# Altium project 音频.PrjPcb
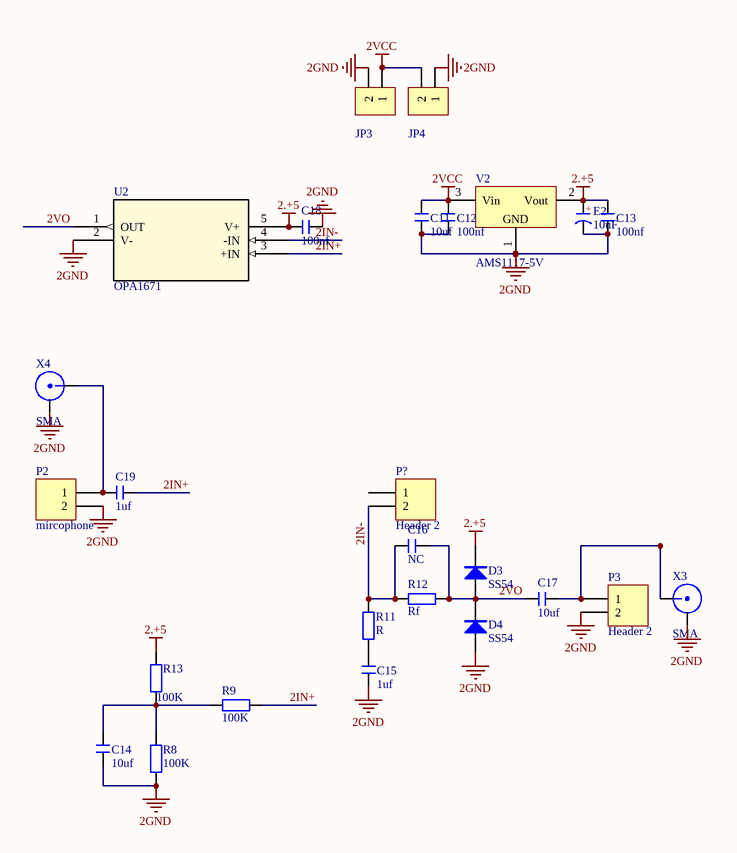
[diagram p0: OPA1671.SchDoc]
2 sheets, 53 parts. Net scope: global (net labels, ports and power ports of the same name join across sheets).
Board file: SoundAmplify.PcbDoc
Sheets:
  OPA1671.SchDoc
  OPA567.SchDoc

## Sheet OPA1671.SchDoc
size A3

### Parts
C11  10uf  [C 0603_L]
C12  100nf  [C 0603_L]
C13  100nf  [C 0603_L]
C14  10uf  [C 0603_L]
C15  1uf  [C 0603_L]
C16  NC  [C 0603_L]
C17  10uf  [C 0603_L]
C18  100nf  [C 0603_L]
C19  1uf  [C 0603_L]
D3  SS54  [SMA]
D4  SS54  [SMA]
E2  10uF  [CD B(3528)]
JP3  HDR-1X2  [VH3.96-LI-2P]  (value not drawn)
JP4  HDR-1X2  [VH3.96-LI-2P]  (value not drawn)
P2  mircophone  [HDR1X2]
P3  Header 2  [HDR1X2]
P?  Header 2  [HDR1X2]
R8  100K  [R 0603_L]
R9  100K  [R 0603_L]
R11  R  [R 0603_L]
R12  Rf  [R 0603_L]
R13  100K  [R 0603_L]
U2  OPA1671  [SOT23-DBV5_TEX]
V2  AMS1117-5V  [SOT223_L]
X3  SMA  [SMA1]
X4  SMA  [SMA1]

### Nets
2.+5: C13.2 C18.2 D3.2(K) E2.1(A) R13.2 U2.5(V+) V2.2(Vout)
2GND: C11.1 C12.1 C13.1 C14.2 C15.1 C18.1 D4.1(A) E2.2(K) JP3.2 JP4.1 P2.2 P3.2 R8.1 U2.2(V-) V2.1(GND) X3.2 X4.2
2VCC: C11.2 C12.2 JP3.1 JP4.2 V2.3(Vin)
2IN+: C19.1 R9.2 U2.3(+IN)
2IN-: C16.2 P?.2 R11.2 R12.2 U2.4(-IN)
2VO: C16.1 C17.2 D3.1(A) D4.2(K) R12.1 U2.1(OUT)
NetC14_1: C14.1 R8.2 R9.1 R13.1
NetC15_2: C15.2 R11.1
NetC17_1: C17.1 P3.1 X3.1
NetC19_2: C19.2 P2.1 X4.1

Not connected (* = marked no-connect by the designer): P? 1

### Notes on the sheet
- (in symbol C-CD) +

### Library data of the parts
C11-C19 = C: 无极性贴片电容; 版权归属: 源创客; BOM名称: 无极性贴片电容; 学习资源: www.ooocke.com
D3 D4 = SR540: 肖特基二极管; BOM名称: 整流二极管; 版权归属: 源创客; 属性: 40V  5A; 学习资源: www.ooocke.com
E2 = C-CD: 贴片钽电容; 版权归属: 源创客; BOM名称: 贴片钽电容; 学习资源: www.ooocke.com
JP3 JP4 = Header 2_1: 2P接插件; 版权归属: 源创客; BOM名称: 2P接插件; 学习资源: www.ooocke.com
P2 P3 P? = Header 2: Header, 2-Pin; LatestRevisionDate: 17-Jul-2002; LatestRevisionNote: Re-released for DXP Platform.; Publisher: Altium Limited
R8 R9 R11-R13 = R: 贴片电阻; 版权归属: 源创客; BOM名称: 贴片电阻; 学习资源: www.ooocke.com
U2 = OPA1671IDBVR: 低噪声音频运算放大器; Mfr_Name: Texas Instruments; Copyright: Copyright (C) 2021 Ultra Librarian. All rights reserved.; Manufacturer_Part_Number: OPA1671IDBVR; RefDes: RefDes; Type: DEV
V2 = AMS1117: 三端稳压芯片; BOM名称: 稳压芯片; 版权归属: 源创客; 学习资源: www.ooocke.com

## Sheet OPA567.SchDoc
size A3
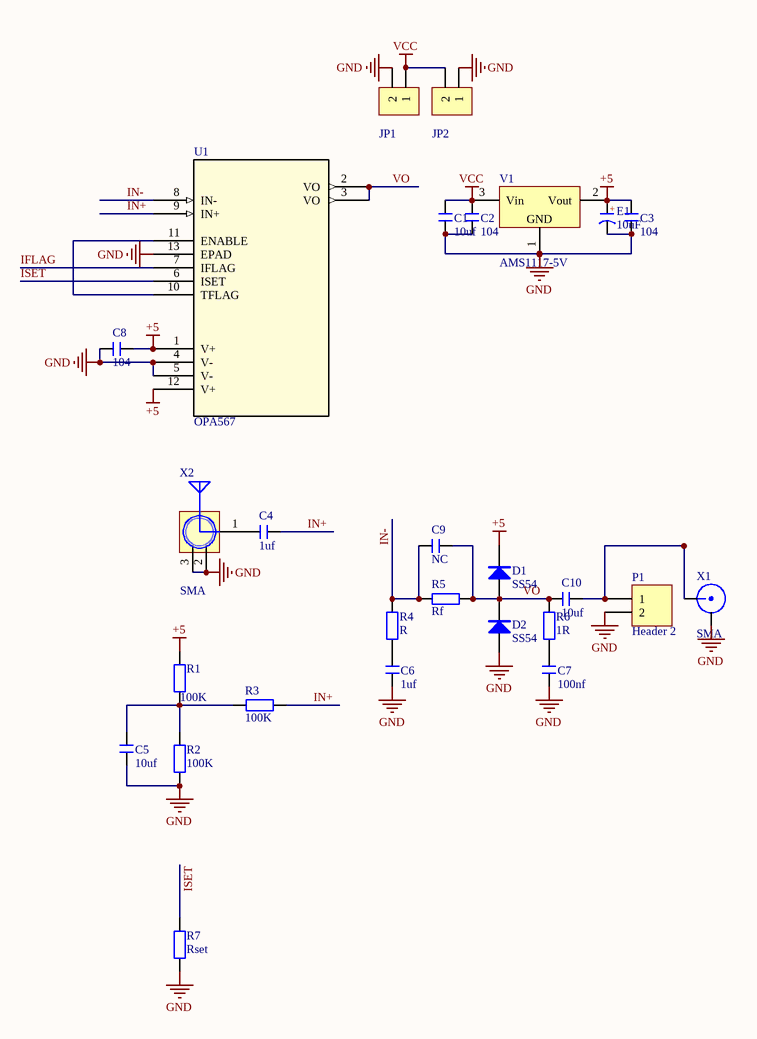
[diagram p1: OPA567.SchDoc]

### Parts
C1  10uf  [C 0603_L]
C2  104  [C 0603_L]
C3  104  [C 0603_L]
C4  1uf  [C 0603_L]
C5  10uf  [C 0603_L]
C6  1uf  [C 0603_L]
C7  100nf  [C 0603_L]
C8  104  [C 0603_L]
C9  NC  [C 0603_L]
C10  10uf  [C 0603_L]
D1  SS54  [SMA]
D2  SS54  [SMA]
E1  10uF  [CD B(3528)]
JP1  HDR-1X2  [VH3.96-LI-2P]  (value not drawn)
JP2  HDR-1X2  [VH3.96-LI-2P]  (value not drawn)
P1  Header 2  [HDR1X2]
R1  100K  [R 0603_L]
R2  100K  [R 0603_L]
R3  100K  [R 0603_L]
R4  R  [R 0603_L]
R5  Rf  [R 0603_L]
R6  1R  [R 0603_L]
R7  Rset  [R 0603_L]
U1  OPA567  [RHG12_3P12X3P12]
V1  AMS1117-5V  [SOT223_L]
X1  SMA  [SMA1]
X2  SMA  [SMA-KE]

### Nets
+5: C3.2 C8.1 D1.2(K) E1.1(A) R1.2 U1.1(V+) U1.12(V+) V1.2(Vout)
GND: C1.1 C2.1 C3.1 C5.2 C6.1 C7.1 C8.2 D2.1(A) E1.2(K) JP1.2 JP2.1 P1.2 R2.1 R7.2 U1.4(V-) U1.5(V-) U1.13(EPAD) V1.1(GND) X1.2 X2.2(GND) X2.3(GND)
VCC: C1.2 C2.2 JP1.1 JP2.2 V1.3(Vin)
IFLAG: U1.7(IFLAG)
IN+: C4.1 R3.2 U1.9(IN+)
IN-: C9.2 R4.2 R5.2 U1.8(IN-)
ISET: R7.1 U1.6(ISET)
VO: C9.1 C10.2 D1.1(A) D2.2(K) R5.1 R6.2 U1.2(VO) U1.3(VO)
NetC4_2: C4.2 X2.1(ANT)
NetC5_1: C5.1 R1.1 R2.2 R3.1
NetC6_2: C6.2 R4.1
NetC7_2: C7.2 R6.1
NetC10_1: C10.1 P1.1 X1.1
NetU1_10: U1.10(TFLAG) U1.11(ENABLE)

### Notes on the sheet
- (in symbol C-CD) +

### Library data of the parts
C1-C10 = C: 无极性贴片电容; 版权归属: 源创客; BOM名称: 无极性贴片电容; 学习资源: www.ooocke.com
D1 D2 = SR540: as D3 on sheet OPA1671; 学习资源: www.ooocke.com
E1 = C-CD: 贴片钽电容; 版权归属: 源创客; BOM名称: 贴片钽电容; 学习资源: www.ooocke.com
JP1 JP2 = Header 2_1: 2P接插件; 版权归属: 源创客; BOM名称: 2P接插件; 学习资源: www.ooocke.com
P1 = Header 2: Header, 2-Pin; LatestRevisionDate: 17-Jul-2002; LatestRevisionNote: Re-released for DXP Platform.; Publisher: Altium Limited
R1-R7 = R: 贴片电阻; 版权归属: 源创客; BOM名称: 贴片电阻; 学习资源: www.ooocke.com
U1 = OPA567AIRHGR: 2A,5V功率放大器; Mfr_Name: Texas Instruments; Copyright: Copyright (C) 2021 Ultra Librarian. All rights reserved.; Manufacturer_Part_Number: OPA567AIRHGR; RefDes: RefDes; Type: DEV
V1 = AMS1117: 三端稳压芯片; BOM名称: 稳压芯片; 版权归属: 源创客; 学习资源: www.ooocke.com
X2 = SMA: SMA-2.4G射频天线接口; 版权归属: 源创客; BOM名称: SMA-2.4G射频天线接口; 学习资源: www.ooocke.com